# Altium project TimeKeeper.PrjPcb
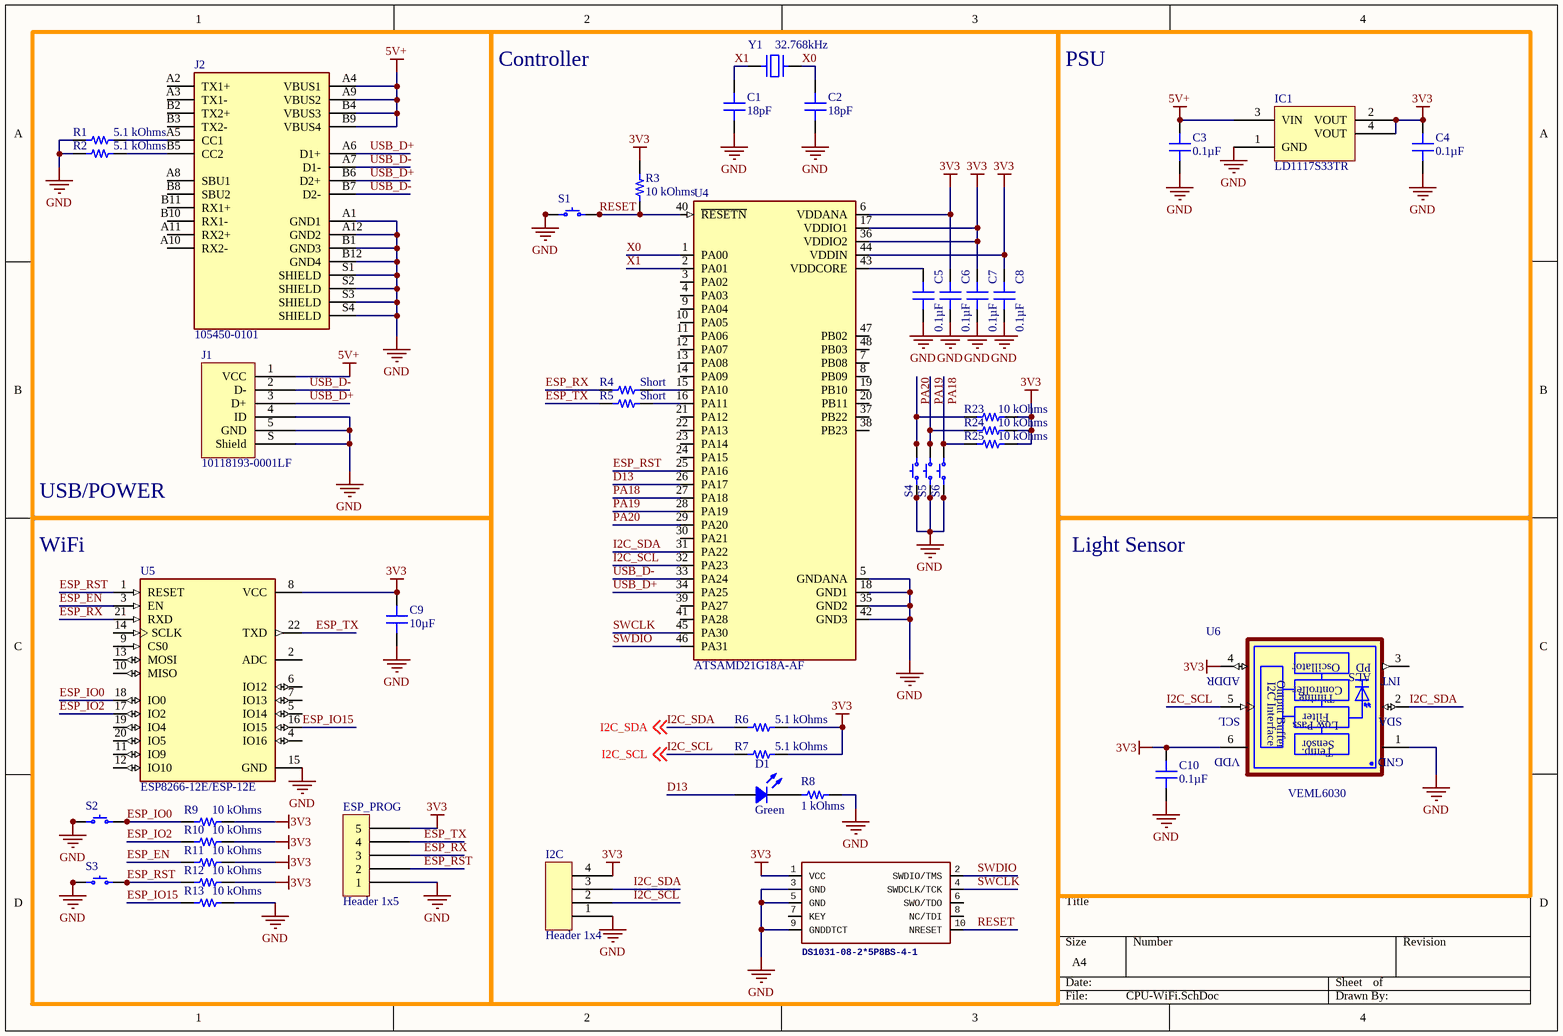
[diagram p0: CPU-WiFi.SchDoc]
2 sheets, 88 parts. Net scope: global (net labels, ports and power ports of the same name join across sheets).
Board files: TimeKeeper2Layer.PcbDoc, TimeKeeper.PcbDoc
Sheets:
  CPU-WiFi.SchDoc
  LED-DRIVER.SchDoc

## Sheet CPU-WiFi.SchDoc
size A4

### Parts
C1  18pF  [CAP 0603_1608]
C2  18pF  [CAP 0603_1608]
C3  0.1µF  [CAP 0603_1608]
C4  0.1µF  [CAP 0603_1608]
C5  0.1µF  [CAP 0603_1608]
C6  0.1µF  [CAP 0603_1608]
C7  0.1µF  [CAP 0603_1608]
C8  0.1µF  [CAP 0603_1608]
C9  10µF  [CAP 0603_1608]
C10  0.1µF  [CAP 0603_1608]
D1  Green  [LED 0805_2012 GREEN]
ESP_PROG  Header 1x5  [Header 1x5 male]
I2C  Header 1x4  [Header 1x4 male]
IC1  LD1117S33TR  [ST SOT-223]
J1  10118193-0001LF  [FCI USB 10118193-0001LF]
J2  105450-0101  [MOLEX_105450-0101]
PROG1  DS1031-08-2*5P8BS-4-1  [2X5-PTH-1.27MM]
R1  5.1 kOhms  [RES 0603_1608]
R2  5.1 kOhms  [RES 0603_1608]
R3  10 kOhms  [RES 0603_1608]
R4  Short  [RES 0603_1608]
R5  Short  [RES 0603_1608]
R6  5.1 kOhms  [RES 0603_1608]
R7  5.1 kOhms  [RES 0603_1608]
R8  1 kOhms  [RES 0603_1608]
R9  10 kOhms  [RES 0603_1608]
R10  10 kOhms  [RES 0603_1608]
R11  10 kOhms  [RES 0603_1608]
R12  10 kOhms  [RES 0603_1608]
R13  10 kOhms  [RES 0603_1608]
R23  10 kOhms  [RES 0603_1608]
R24  10 kOhms  [RES 0603_1608]
R25  10 kOhms  [RES 0603_1608]
S1  B3S-1000P  [OMRON B3S-1000P]  (value not drawn)
S2  B3S-1000P  [OMRON B3S-1000P]  (value not drawn)
S3  B3S-1000P  [OMRON B3S-1000P]  (value not drawn)
S4  B3S-1000P  [OMRON B3S-1000P]  (value not drawn)
S5  B3S-1000P  [OMRON B3S-1000P]  (value not drawn)
S6  B3S-1000P  [OMRON B3S-1000P]  (value not drawn)
U4  ATSAMD21G18A-AF  [QFP50P900X900X120-48N]
U5  ESP8266-12E/ESP-12E  [XCVR_ESP8266-12E/ESP-12E]
U6  VEML6030  [VISHAY_VEML6030_2X2X0.87]
Y1  32.768kHz  [ABRACON ABS07]

### Blocks framed on the sheet
USB/POWER: J1 J2 R1 R2
Controller: C1 C2 C5-C8 D1 I2C PROG1 R3-R8 R23-R25 S1 S4-S6 U4 Y1
PSU: C3 C4 IC1
Light Sensor: C10 U6

### Nets
3V3: C4.2 C6.2 C7.2 C8.2 C9.2 C10.2 ESP_PROG.5 I2C.4 IC1.2(VOUT) IC1.4(VOUT) PROG1.1(VCC) R3.2 R6.2 R7.2 R9.2 R10.2 R11.2 R12.2 R23.1 R24.1 R25.1 U4.6(VDDANA) U4.17(VDDIO1) U4.36(VDDIO2) U4.44(VDDIN) U5.8(VCC) U6.4(ADDR) U6.6(VDD)
5V+: C3.2 IC1.3(VIN) J1.1(VCC) J2.A4(VBUS1) J2.A9(VBUS2) J2.B4(VBUS3) J2.B9(VBUS4)
GND: C1.1 C2.1 C3.1 C4.1 C5.1 C6.1 C7.1 C8.1 C9.1 C10.1 ESP_PROG.1 I2C.1 IC1.1(GND) J1.4(ID) J1.5(GND) J1.S(Shield) J2.A1(GND1) J2.A12(GND2) J2.B1(GND3) J2.B12(GND4) J2.S1(SHIELD) J2.S2(SHIELD) J2.S3(SHIELD) J2.S4(SHIELD) PROG1.3(GND) PROG1.5(GND) PROG1.9(GNDDTCT) R1.1 R2.1 R8.2 R13.2 S1.1 S1.2 S2.1 S2.2 S3.1 S3.2 S4.1 S4.2 S5.1 S5.2 S6.1 S6.2 U4.5(GNDANA) U4.18(GND1) U4.35(GND2) U4.42(GND3) U5.15(GND) U6.1(GND)
D13: D1.1 U4.26(PA17)
ESP_EN: R11.1 U5.3(EN)
ESP_IO0: R9.1 S2.3 S2.4 U5.18(IO0)
ESP_IO2: R10.1 U5.17(IO2)
ESP_IO15: R13.1 U5.16(IO15)
ESP_RST: ESP_PROG.2 R12.1 S3.3 S3.4 U4.25(PA16) U5.1(RESET)
ESP_RX: ESP_PROG.3 R4.1 U5.21(RXD)
ESP_TX: ESP_PROG.4 R5.1 U5.22(TXD)
I2C_SCL: I2C.2 R7.1 U4.32(PA23) U6.5(SCL) ; off-sheet I2C_SCL
I2C_SDA: I2C.3 R6.1 U4.31(PA22) U6.2(SDA) ; off-sheet I2C_SDA
PA18: R25.2 S6.3 S6.4 U4.27(PA18)
PA19: R24.2 S5.3 S5.4 U4.28(PA19)
PA20: R23.2 S4.3 S4.4 U4.29(PA20)
RESET: PROG1.10(NRESET) R3.1 S1.3 S1.4 U4.40(~{RESETN})
SWCLK: PROG1.4(SWDCLK/TCK) U4.45(PA30)
SWDIO: PROG1.2(SWDIO/TMS) U4.46(PA31)
USB_D+: J1.3(D+) J2.A6(D1+) J2.B6(D2+) U4.34(PA25)
USB_D-: J1.2(D-) J2.A7(D1-) J2.B7(D2-) U4.33(PA24)
X0: C2.2 U4.1(PA00) Y1.2
X1: C1.2 U4.2(PA01) Y1.1
NetC5_2: C5.2 U4.43(VDDCORE)
NetD1_2: D1.2 R8.1
NetJ2_A5: J2.A5(CC1) R1.2
NetJ2_B5: J2.B5(CC2) R2.2
NetR4_2: R4.2 U4.15(PA10)
NetR5_2: R5.2 U4.16(PA11)

Not connected (* = marked no-connect by the designer): J2 A2(TX1+) A3(TX1-) A8(SBU1) A10(RX2-) A11(RX2+) B2(TX2+) B3(TX2-) B8(SBU2) B10(RX1-) B11(RX1+); PROG1 6(SWO/TDO) 7(KEY) 8(NC/TDI); U4 3(PA02) 4(PA03) 7(PB08) 8(PB09) 9(PA04) 10(PA05) 11(PA06) 12(PA07) 13(PA08) 14(PA09) 19(PB10) 20(PB11) 21(PA12) 22(PA13) 23(PA14) 24(PA15) 30(PA21) 37(PB22) 38(PB23) 39(PA27) 41(PA28) 47(PB02) 48(PB03); U5 2(ADC) 4(IO16) 5(IO14) 6(IO12) 7(IO13) 9(CS0) 10(MISO) 11(IO9) 12(IO10) 13(MOSI) 14(SCLK) 19(IO4) 20(IO5); U6 3(INT)

### Notes on the sheet
- WiFi
- (in symbol VEML6030) Oscillator; PD; ALS; I2C Interface; Output Buffer; Controller; Timing; Filter; Low Pass; Sensor; Temp.

### Library data of the parts
C1 C2 = C0603X180J5GACTU: CAP CER 18PF 50V C0G/NP0 0603; Manufacturer: KEMET; Temperature Coefficient: C0G, NP0; Tolerance: ±5%; Part Number: C0603X180J5GACTU; Value: 18pF; Applications: Boardflex Sensitive; Capacitance: 18pF; ComponentLink1Description: Datasheet; ComponentLink1URL: https://api.kemet.com/component-edge/download/specsheet/C0603X180J5GACTU.pdf; ComponentLink2Description: DigiKey Link; ComponentLink2URL: http://digikey.com/product-detail/en/kemet/C0603X180J5GACTU/399-7390-1-ND/3317424; Device Package: 0603 (1608 Metric); Features: Low ESL, Soft Termination; LastUpdated: 21/01/2020 00:02:09; Lifecycle Status: Active; Minimum Order: 1; Mounting Type: Surface Mount, MLCC; Operating Temperature: -55°C ~ 125°C; Package / Case: 0603 (1608 Metric); Packaging: TapeAndReel; PartId: 2471; Part Status: Active; Price: 0.08; Series: SMD Comm C0G Flex; Size / Dimension: 0.063" L x 0.031" W (1.60mm x 0.80mm); Supplier 1: DigiKey; Supplier Part Number 1: 399-7390-1-ND; Thickness (Max): 0.034" (0.87mm); Voltage - Rated: 50V
C3-C8 C10 = C0603T104K3RAL7867: CAP CER 0.1UF 25V X7R 0603; Manufacturer: KEMET; Ratings: COTS; Tolerance: ±10%; Part Number: C0603T104K3RAL7867; Value: 0.1µF; Applications: High Reliability, Bypass, Decoupling; Capacitance: 0.1µF; ComponentLink1Description: Datasheet; ComponentLink1URL: https://api.kemet.com/component-edge/download/datasheet/C0603T104K3RAL7867.pdf; ComponentLink2Description: DigiKey Link; ComponentLink2URL: http://digikey.com/product-detail/en/kemet/C0603T104K3RAL7867/399-14540-1-ND/7103832; Device Package: 0603 (1608 Metric); LastUpdated: 21/01/2020 00:02:09; Lifecycle Status: Active; Minimum Order: 1; Mounting Type: Surface Mount, MLCC; Operating Temperature: -55°C ~ 125°C; Package / Case: 0603 (1608 Metric); Packaging: TapeAndReel; PartId: 2525; Part Status: Active; Price: 0.23; Series: SMD COTS X7R; Size / Dimension: 0.063" L x 0.031" W (1.60mm x 0.80mm); Supplier 1: DigiKey; Supplier Part Number 1: 399-14540-1-ND; Temperature Coefficient: X7R; Thickness (Max): 0.034" (0.87mm); Voltage - Rated: 25V
C9 = GRM188R60J106ME47D: CAP CER 10UF 6.3V X5R 0603; Manufacturer: Murata Electronics; Tolerance: ±20%; Part Number: GRM188R60J106ME47D; Value: 10µF; Applications: General Purpose; Capacitance: 10µF; ComponentLink1Description: Datasheet; ComponentLink1URL: https://www.murata.com/~/media/webrenewal/support/library/catalog/products/capacitor/mlcc/c02e.ashx?la=en-us; ComponentLink2Description: DigiKey Link; ComponentLink2URL: http://digikey.com/product-detail/en/murata-electronics/GRM188R60J106ME47D/490-3896-1-ND/965938; Device Package: 0603 (1608 Metric); LastUpdated: 21/01/2020 00:02:09; Lifecycle Status: Active; Minimum Order: 1; Mounting Type: Surface Mount, MLCC; Operating Temperature: -55°C ~ 85°C; Package / Case: 0603 (1608 Metric); Packaging: TapeAndReel; PartId: 2351; Part Status: Active; Price: 0.08; Series: GRM; Size / Dimension: 0.063" L x 0.031" W (1.60mm x 0.80mm); Supplier 1: DigiKey; Supplier Part Number 1: 490-3896-1-ND; Temperature Coefficient: X5R; Thickness (Max): 0.035" (0.90mm); Voltage - Rated: 6.3V
D1 = SML-LX0805UPGC-TR: LED GREEN CLEAR SMD; Manufacturer: Lumex Opto/Components Inc.; Configuration: Standard; Current - Test: 20mA; Lens Color: Colorless; Lens Size: 1.40mm x 1.25mm; Lens Style: Rectangle with Flat Top; Millicandela Rating: 199mcd; Viewing Angle: 140°; Voltage - Forward (Vf) (Typ): 3.5V; Wavelength - Peak: 518nm; Part Number: SML-LX0805UPGC-TR; Color: Green; ComponentLink1Description: Datasheet; ComponentLink1URL: https://www.lumex.com/content/files/ProductAttachment/SML-LX0805UPGC-TR.pdf; ComponentLink2Description: DigiKey Link; ComponentLink2URL: http://digikey.com/product-detail/en/lumex-opto-components-inc/SML-LX0805UPGC-TR/67-1640-1-ND/408129; Device Package: 0805 (2012 Metric); LastUpdated: 21/01/2020 03:14:04; Lens Transparency: Clear; Lifecycle Status: Active; Minimum Order: 1; Mounting Type: Surface Mount; Package / Case: 0805 (2012 Metric); Packaging: TapeAndReel; PartId: 304; Part Status: Active; Price: 0.69; Series: -; Size / Dimension: 2.00mm L x 1.25mm W; Supplier 1: DigiKey; Supplier Part Number 1: 67-1640-1-ND; Value: Green
IC1 = LD1117S33TR: IC REG LINEAR 3.3V 800MA SOT223; Manufacturer: STMicroelectronics; Current - Quiescent (Iq): 10mA; Number of Regulators: 1; Output Configuration: Positive; Output Type: Fixed; Protection Features: Over Current, Over Temperature; PSRR: 75dB (120Hz); Voltage Dropout (Max): 1.2V @ 800mA; Voltage - Input (Max): 15V; Part Number: LD1117S33TR; ComponentLink1Description: Datasheet; ComponentLink1URL: http://www.st.com/content/ccc/resource/technical/document/datasheet/99/3b/7d/91/91/51/4b/be/CD00000544.pdf/files/CD00000544.pdf/jcr:content/translations/en.CD00000544.pdf; ComponentLink2Description: DigiKey Link; ComponentLink2URL: http://digikey.com/product-detail/en/stmicroelectronics/LD1117S33TR/497-1242-1-ND/586242; Current - Output: 800mA; Device Package: TO-261-4, TO-261AA; LastUpdated: 21/01/2020 03:56:43; Lifecycle Status: Active; Minimum Order: 1; Mounting Type: Surface Mount; Operating Temperature: 0°C ~ 125°C; Package / Case: TO-261-4, TO-261AA; Packaging: TapeAndReel; Part Status: Active; Price: 0.14; Series: -; Supplier 1: DigiKey; Supplier Part Number 1: 497-1242-1-ND; Supplier Device Package: SOT-223; Voltage - Output (Min/Fixed): 3.3V
J1 = 10118193-0001LF: CONN RCPT USB2.0 MICRO B SMD R/A; Manufacturer: Amphenol ICC (FCI); Connector Type: USB - micro B; Current Rating (Amps): 1.8A per Contact; Gender: Receptacle; Mating Cycles: 10000; Number of Contacts: 5; Number of Ports: 1; Shielding: Shielded; Voltage - Rated: 100VAC; Part Number: 10118193-0001LF; ComponentLink1Description: Datasheet; ComponentLink1URL: https://cdn.amphenol-icc.com/media/wysiwyg/files/documentation/datasheet/inputoutput/io_usb_micro.pdf; ComponentLink2Description: DigiKey Link; ComponentLink2URL: //digikey.com/product-detail/en/amphenol-icc-fci/10118193-0001LF/609-4616-2-ND/2785388; Features: Solder Retention; LastUpdated: 09/12/2019 20:51:28; Lifecycle Status: 0; Minimum Order: 1; Mounting Feature: Horizontal; Mounting Type: Surface Mount, Right Angle; Through Hole; Operating Temperature: -30°C ~ 80°C; Packaging: TapeAndReel; Part Status: Active; Price: 0.21; Series: -; Specifications: USB 2.0; Supplier 1: DigiKey; Supplier Part Number 1: 609-4616-2-ND; Termination: Solder
J2 = 105450-0101: USB-C _USB TYPE-C_ USB 3.1 _USB 3.1 Gen 2, Superspeed+_ Receptacle Connector 24 Position Surface Mount, Right Angle; Through Hole; MF: Molex; MP: 1054500101; Package: None; Digi-Key_Part_Number: WM12856CT-ND; SnapEDA_Link: https://www.snapeda.com/parts/1054500101/Molex/view-part/448528/?ref=snap; Digi-Key_Purchase_URL: https://www.digikey.tw/product-detail/en/molex/1054500101/WM12856CT-ND/5843891?utm_source=snapeda&utm_medium=aggregator&utm_campaign=symbol; Value: *
PROG1 = CORTEX_DEBUGPTH: Cortex Debug ConnectorDatasheet; GateName_1: G$1; DeviceName: PTH; SymbolName_1: CORTEX_DEBUG; LibraryName: samd21; DeviceSetName: CORTEX_DEBUG; NAME: *
R1 R2 R6 R7 = AC0603JR-075K1L: RES SMD 5.1K OHM 5% 1/10W 0603; Manufacturer: Yageo; Power (Watts): 0.1W, 1/10W; Temperature Coefficient: ±100ppm/°C; Part Number: AC0603JR-075K1L; Value: 5.1 kOhms; ComponentLink1Description: Datasheet; ComponentLink1URL: https://www.yageo.com/upload/media/product/productsearch/datasheet/rchip/PYu-AC_51_RoHS_L_7.pdf; ComponentLink2Description: DigiKey Link; ComponentLink2URL: http://digikey.com/product-detail/en/yageo/AC0603JR-075K1L/YAG3682CT-ND/6006531; Composition: Thick Film; Device Package: 0603 (1608 Metric); Features: Automotive AEC-Q200, Moisture Resistant; Height - Seated (Max): 0.022" (0.55mm); LastUpdated: 21/01/2020 00:23:35; Lifecycle Status: Active; Minimum Order: 1; Number of Terminations: 2; Operating Temperature: -55°C ~ 155°C; Package / Case: 0603 (1608 Metric); Packaging: CutTape; PartId: 8336; Part Status: Active; Price: 0.10; Ratings: AEC-Q200; Resistance: 5.1 kOhms; Series: AC; Size / Dimension: 0.063" L x 0.031" W (1.60mm x 0.80mm); Supplier 1: DigiKey; Supplier Part Number 1: YAG3682CT-ND; Supplier Device Package: 0603; Tolerance: ±5%
R3 R9-R13 R23-R25 = CPF0603B10KE: RES SMD 10K OHM 0.1% 1/16W 0603; Manufacturer: TE Connectivity Passive Product; Power (Watts): 0.063W, 1/16W; Temperature Coefficient: ±25ppm/°C; Part Number: CPF0603B10KE; Value: 10 kOhms; ComponentLink1Description: Datasheet; ComponentLink1URL: https://www.te.com/commerce/DocumentDelivery/DDEController?Action=srchrtrv&DocNm=1773200&DocType=DS&DocLang=English; ComponentLink2Description: DigiKey Link; ComponentLink2URL: http://digikey.com/product-detail/en/te-connectivity-passive-product/CPF0603B10KE/A119886CT-ND/4966484; Composition: Thin Film; Device Package: 0603 (1608 Metric); Height - Seated (Max): 0.022" (0.55mm); LastUpdated: 21/01/2020 00:24:55; Lifecycle Status: Active; Minimum Order: 1; Number of Terminations: 2; Operating Temperature: -55°C ~ 155°C; Package / Case: 0603 (1608 Metric); Packaging: TapeAndReel; PartId: 4872; Part Status: Active; Price: 0.09; Resistance: 10 kOhms; Series: CPF, Neohm; Size / Dimension: 0.061" L x 0.031" W (1.55mm x 0.80mm); Supplier 1: DigiKey; Supplier Part Number 1: A119886CT-ND; Supplier Device Package: 0603; Tolerance: ±0.1%
R4 R5 = HCJ0603ZT0R00: RES 0 OHM JUMPER 1/4W 0603; Manufacturer: Stackpole Electronics Inc; Power (Watts): 0.25W, 1/4W; Resistance: 0 Ohms; Part Number: HCJ0603ZT0R00; Value: Short; ComponentLink1Description: Datasheet; ComponentLink1URL: https://www.seielect.com/catalog/sei-hcj.pdf; ComponentLink2Description: DigiKey Link; ComponentLink2URL: http://digikey.com/product-detail/en/stackpole-electronics-inc/HCJ0603ZT0R00/HCJ0603ZT0R00CT-ND/4357665; Composition: Metal Foil; Device Package: 0603 (1608 Metric); Features: Automotive AEC-Q200; Height - Seated (Max): 0.018" (0.45mm); LastUpdated: 21/01/2020 00:22:48; Lifecycle Status: Active; Minimum Order: 1; Number of Terminations: 2; Operating Temperature: -55°C ~ 155°C; Package / Case: 0603 (1608 Metric); Packaging: TapeAndReel; PartId: 10189; Part Status: Active; Price: 0.07; Ratings: AEC-Q200; Series: HCJ; Size / Dimension: 0.061" L x 0.031" W (1.55mm x 0.80mm); Supplier 1: DigiKey; Supplier Part Number 1: HCJ0603ZT0R00CT-ND; Supplier Device Package: 0603; Tolerance: Jumper
R8 = CR0603-FX-1001ELF: RES SMD 1K OHM 1% 1/10W 0603; Manufacturer: Bourns Inc.; Power (Watts): 0.1W, 1/10W; Temperature Coefficient: ±100ppm/°C; Part Number: CR0603-FX-1001ELF; Value: 1 kOhms; ComponentLink1Description: Datasheet; ComponentLink1URL: https://www.bourns.com/docs/Product-Datasheets/CHPREZTR.pdf; ComponentLink2Description: DigiKey Link; ComponentLink2URL: http://digikey.com/product-detail/en/bourns-inc/CR0603-FX-1001ELF/CR0603-FX-1001ELFCT-ND/3592910; Composition: Thick Film; Device Package: 0603 (1608 Metric); Features: Moisture Resistant; Height - Seated (Max): 0.022" (0.55mm); LastUpdated: 21/01/2020 00:19:55; Lifecycle Status: Active; Minimum Order: 1; Number of Terminations: 2; Operating Temperature: -55°C ~ 155°C; Package / Case: 0603 (1608 Metric); Packaging: CutTape; PartId: 17323; Part Status: Active; Price: 0.10; Resistance: 1 kOhms; Series: CR0603; Size / Dimension: 0.063" L x 0.031" W (1.60mm x 0.80mm); Supplier 1: DigiKey; Supplier Part Number 1: CR0603-FX-1001ELFCT-ND; Supplier Device Package: 0603; Tolerance: ±1%
S1-S6 = B3S-1000P: SWITCH TACTILE SPST-NO 0.05A 24V; Manufacturer: Omron Electronics Inc-EMC Div; Actuator Height off PCB, Vertical: 4.30mm; Actuator Orientation: Top Actuated; Actuator Type: Standard; Contact Rating @ Voltage: 0.05A @ 24VDC; Illumination: Non-Illuminated; Ingress Protection: IP67 - Dust Tight, Waterproof; Operating Force: 160gf; Outline: 6.60mm x 6.00mm; Switch Function: Off-Mom; Part Number: B3S-1000P; Circuit: SPST-NO; ComponentLink1Description: Datasheet; ComponentLink1URL: https://omronfs.omron.com/en_US/ecb/products/pdf/en-b3s.pdf; ComponentLink2Description: DigiKey Link; ComponentLink2URL: http://digikey.com/product-detail/en/omron-electronics-inc-emc-div/B3S-1000P/SW836CT-ND/700012; Features: Sealed - Fully; LastUpdated: 31/01/2020 01:36:13; Lifecycle Status: Active; Minimum Order: 1; Mounting Type: Surface Mount; Operating Temperature: -25°C ~ 70°C; Packaging: TapeAndReel; Part Status: Active; Price: 0.39; Series: B3S; Supplier 1: DigiKey; Supplier Part Number 1: SW836CT-ND; Termination Style: Gull Wing
U4 = ATSAMD21G18A-AF: ARMÂ® CortexÂ®-M0+ Automotive, AEC-Q100, SAM D21G Microcontroller IC 32-Bit 48MHz 256KB _256K x 8_ FLASH 48-TQFP _7x7_; MF: Microchip; Availability: Unavailable; MP: ATSAMD21G18A-AF; Package: TQFP-48 Microchip; SnapEDA_Link: https://www.snapeda.com/parts/ATSAMD21G18A-AF/Microchip/view-part/1216117/?ref=snap; Value: *; Price: None
U5 = ESP8266-12E/ESP-12E: This WiFi module has a 32-bit MCU micro and clock speeds supporting 80 MHz or 160 MHz. Supports the RTOS and integrated Wi-Fi MAC/BB/RF/PA/LNA, and has an on-board antenna.; MF: AI-Thinker; Price: None; Package: None; Value: *; MP: ESP8266-12E/ESP-12E; Availability: Unavailable; SnapEDA_Link: https://www.snapeda.com/parts/ESP8266-12E/ESP-12E/AI-Thinker/view-part/106414/?ref=snap
U6 = VEML6030: Optical Sensor Ambient 550nm IÂ²C 6-SMD, No Lead; MF: Vishay; Value: *; Price: None; Package: SMD-6 Vishay; SnapEDA_Link: https://www.snapeda.com/parts/VEML6030/Vishay%20Semiconductor%20Opto%20Division/view-part/493148/?ref=snap; Availability: Unavailable; MP: VEML6030
Y1 = ABS07-32.768KHZ-T: CRYSTAL 32.7680KHZ 12.5PF SMD; Manufacturer: Abracon LLC; ESR (Equivalent Series Resistance): 70 kOhms; Frequency Tolerance: ±20ppm; Operating Mode: Fundamental; Part Number: ABS07-32.768KHZ-T; ComponentLink1Description: Datasheet; ComponentLink1URL: https://abracon.com/Resonators/ABS07.pdf; ComponentLink2Description: DigiKey Link; ComponentLink2URL: http://digikey.com/product-detail/en/abracon-llc/ABS07-32.768KHZ-T/535-9542-1-ND/1237009; Device Package: 2-SMD, No Lead; Frequency: 32.768kHz; Height - Seated (Max): 0.035" (0.90mm); LastUpdated: 21/01/2020 03:21:15; Lifecycle Status: Active; Load Capacitance: 12.5pF; Minimum Order: 1; Mounting Type: Surface Mount; Operating Temperature: -40°C ~ 85°C; Package / Case: 2-SMD, No Lead; Packaging: TapeAndReel; PartId: 382; Part Status: Active; Price: 0.32; Series: ABS07; Size / Dimension: 0.126" L x 0.059" W (3.20mm x 1.50mm); Supplier 1: DigiKey; Supplier Part Number 1: 535-9542-1-ND; Type: kHz Crystal (Tuning Fork); Value: 32.768kHz

## Sheet LED-DRIVER.SchDoc
size A3
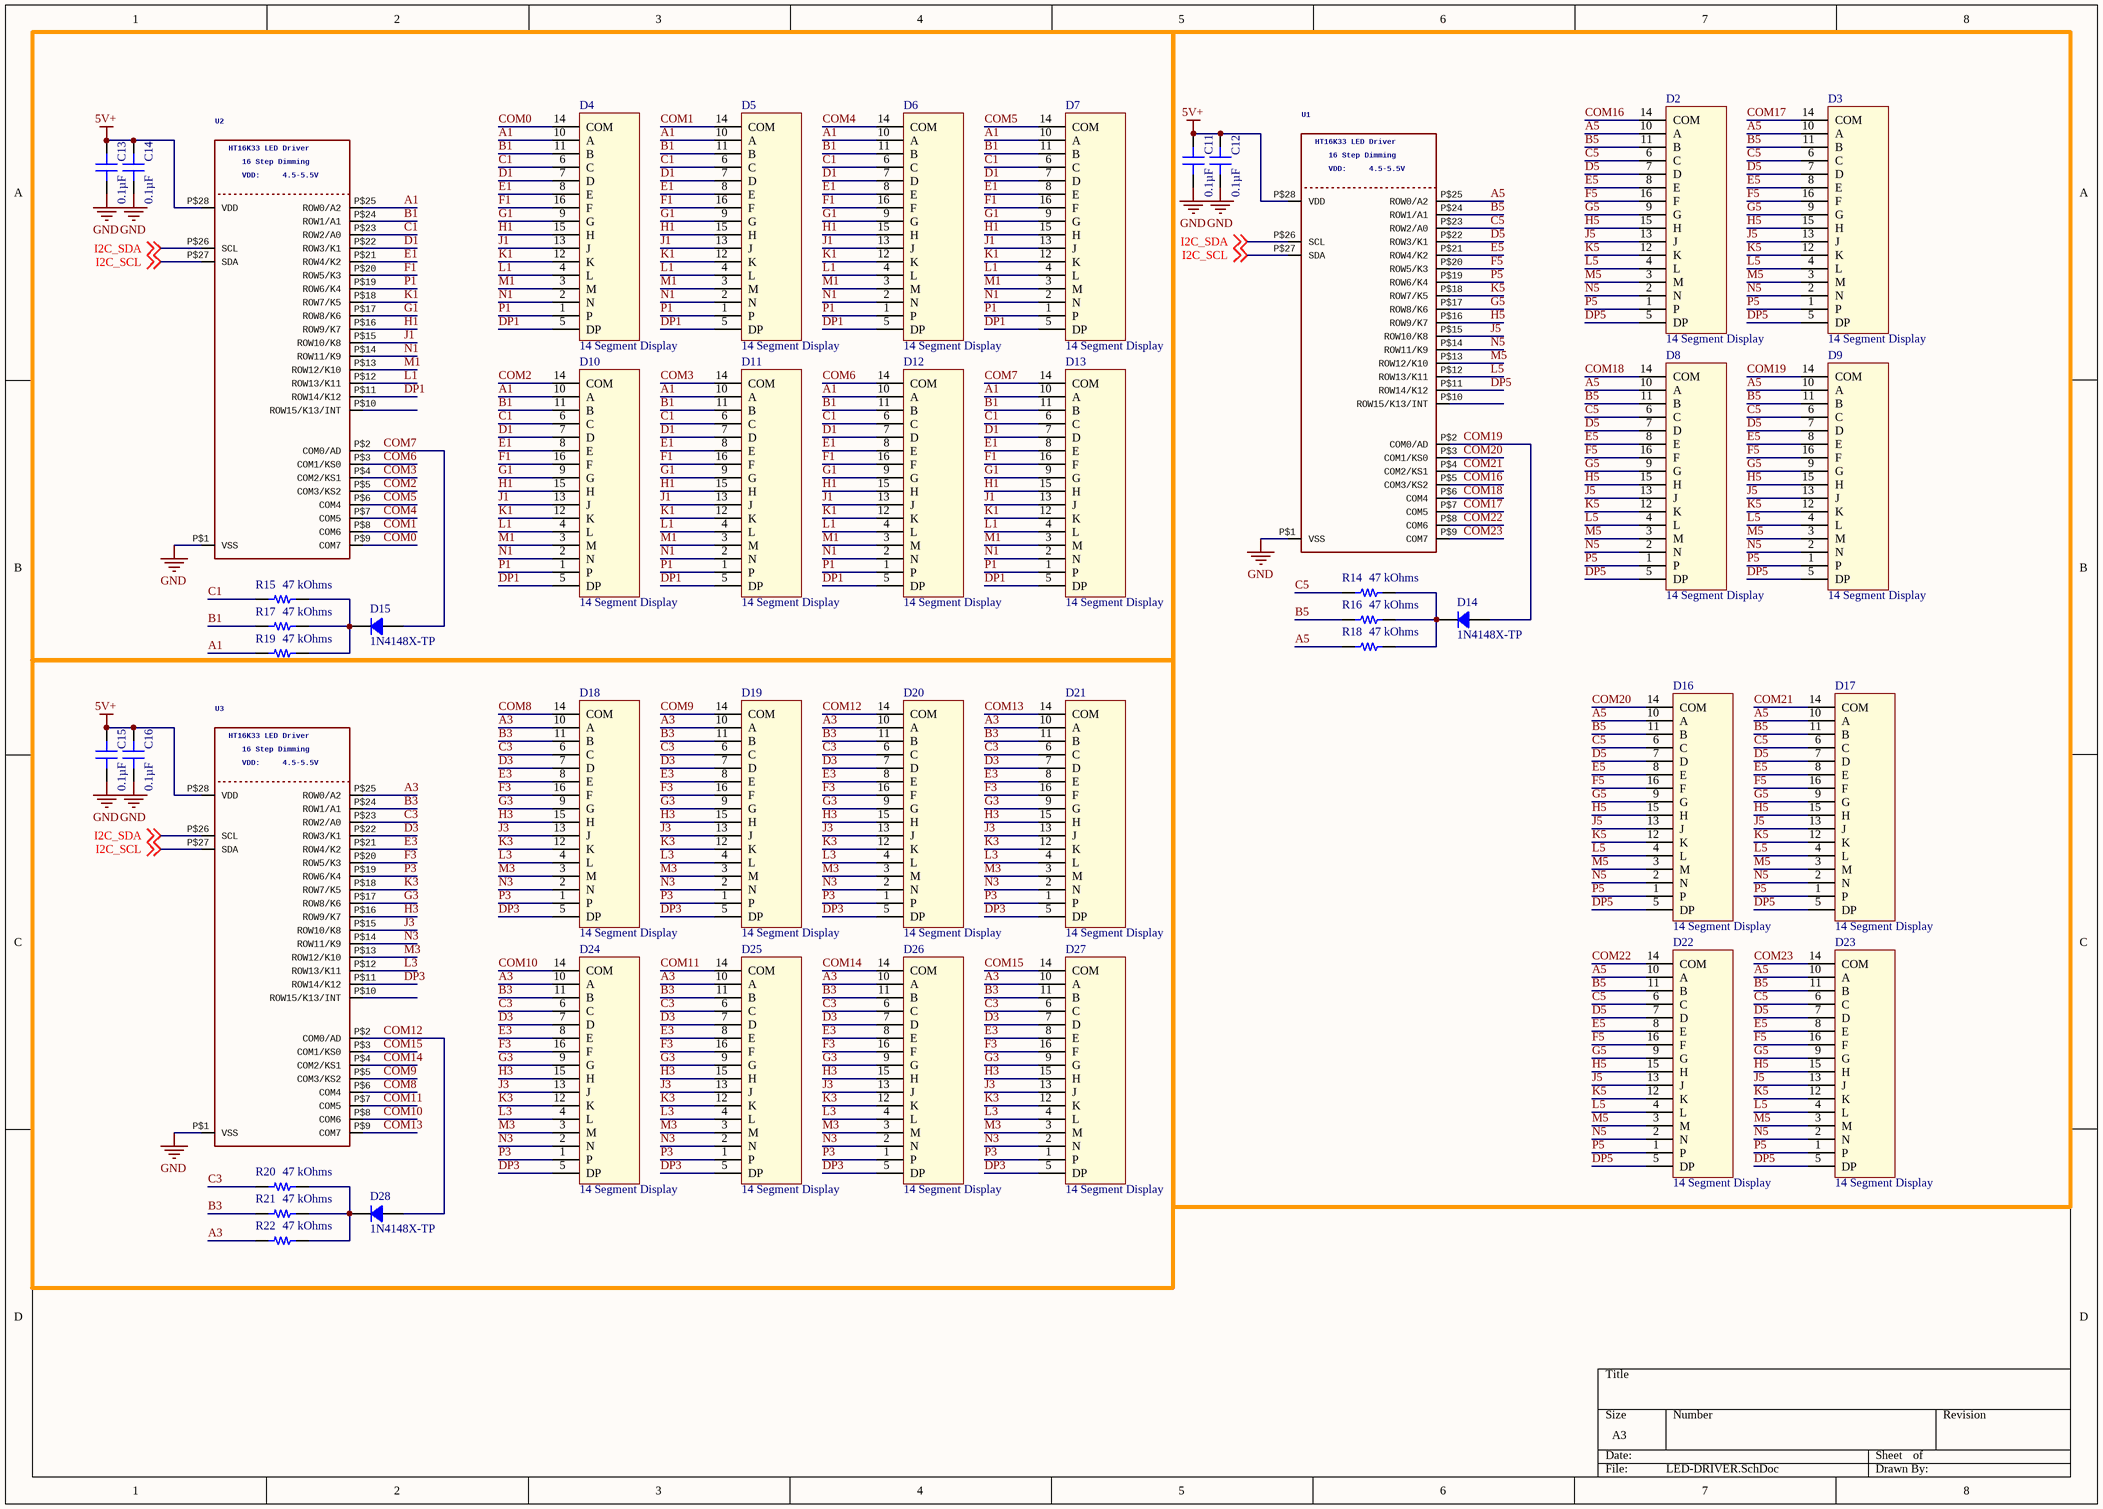
[diagram p1: LED-DRIVER.SchDoc]

### Parts
C11  0.1µF  [CAP 0603_1608]
C12  0.1µF  [CAP 0603_1608]
C13  0.1µF  [CAP 0603_1608]
C14  0.1µF  [CAP 0603_1608]
C15  0.1µF  [CAP 0603_1608]
C16  0.1µF  [CAP 0603_1608]
D2  14 Segment Display  [14 Seg Display]
D3  14 Segment Display  [14 Seg Display]
D4  14 Segment Display  [14 Seg Display]
D5  14 Segment Display  [14 Seg Display]
D6  14 Segment Display  [14 Seg Display]
D7  14 Segment Display  [14 Seg Display]
D8  14 Segment Display  [14 Seg Display]
D9  14 Segment Display  [14 Seg Display]
D10  14 Segment Display  [14 Seg Display]
D11  14 Segment Display  [14 Seg Display]
D12  14 Segment Display  [14 Seg Display]
D13  14 Segment Display  [14 Seg Display]
D14  1N4148X-TP  [SOD-523]
D15  1N4148X-TP  [SOD-523]
D16  14 Segment Display  [14 Seg Display]
D17  14 Segment Display  [14 Seg Display]
D18  14 Segment Display  [14 Seg Display]
D19  14 Segment Display  [14 Seg Display]
D20  14 Segment Display  [14 Seg Display]
D21  14 Segment Display  [14 Seg Display]
D22  14 Segment Display  [14 Seg Display]
D23  14 Segment Display  [14 Seg Display]
D24  14 Segment Display  [14 Seg Display]
D25  14 Segment Display  [14 Seg Display]
D26  14 Segment Display  [14 Seg Display]
D27  14 Segment Display  [14 Seg Display]
D28  1N4148X-TP  [SOD-523]
R14  47 kOhms  [RES 0603_1608]
R15  47 kOhms  [RES 0603_1608]
R16  47 kOhms  [RES 0603_1608]
R17  47 kOhms  [RES 0603_1608]
R18  47 kOhms  [RES 0603_1608]
R19  47 kOhms  [RES 0603_1608]
R20  47 kOhms  [RES 0603_1608]
R21  47 kOhms  [RES 0603_1608]
R22  47 kOhms  [RES 0603_1608]
U1  HT16K33LEDDriver: HT16K33 LED Driver  VDD: VDD:  16StepDimming: 16 Step Dimming  [SOP28_300MIL_SKINNY]  (hidden comment: HT16K33_SOP28_SKINNY)
U2  HT16K33LEDDriver: HT16K33 LED Driver  VDD: VDD:  16StepDimming: 16 Step Dimming  [SOP28_300MIL_SKINNY]  (hidden comment: HT16K33_SOP28_SKINNY)
U3  HT16K33LEDDriver: HT16K33 LED Driver  VDD: VDD:  16StepDimming: 16 Step Dimming  [SOP28_300MIL_SKINNY]  (hidden comment: HT16K33_SOP28_SKINNY)

### Nets
5V+: C11.2 C12.2 C13.2 C14.2 C15.2 C16.2 U1.P$28(VDD) U2.P$28(VDD) U3.P$28(VDD)
GND: C11.1 C12.1 C13.1 C14.1 C15.1 C16.1 U1.P$1(VSS) U2.P$1(VSS) U3.P$1(VSS)
A1: D4.10(A) D5.10(A) D6.10(A) D7.10(A) D10.10(A) D11.10(A) D12.10(A) D13.10(A) R19.1 U2.P$25(ROW0/A2)
A3: D18.10(A) D19.10(A) D20.10(A) D21.10(A) D24.10(A) D25.10(A) D26.10(A) D27.10(A) R22.1 U3.P$25(ROW0/A2)
A5: D2.10(A) D3.10(A) D8.10(A) D9.10(A) D16.10(A) D17.10(A) D22.10(A) D23.10(A) R18.1 U1.P$25(ROW0/A2)
B1: D4.11(B) D5.11(B) D6.11(B) D7.11(B) D10.11(B) D11.11(B) D12.11(B) D13.11(B) R17.1 U2.P$24(ROW1/A1)
B3: D18.11(B) D19.11(B) D20.11(B) D21.11(B) D24.11(B) D25.11(B) D26.11(B) D27.11(B) R21.1 U3.P$24(ROW1/A1)
B5: D2.11(B) D3.11(B) D8.11(B) D9.11(B) D16.11(B) D17.11(B) D22.11(B) D23.11(B) R16.1 U1.P$24(ROW1/A1)
C1: D4.6(C) D5.6(C) D6.6(C) D7.6(C) D10.6(C) D11.6(C) D12.6(C) D13.6(C) R15.1 U2.P$23(ROW2/A0)
C3: D18.6(C) D19.6(C) D20.6(C) D21.6(C) D24.6(C) D25.6(C) D26.6(C) D27.6(C) R20.1 U3.P$23(ROW2/A0)
C5: D2.6(C) D3.6(C) D8.6(C) D9.6(C) D16.6(C) D17.6(C) D22.6(C) D23.6(C) R14.1 U1.P$23(ROW2/A0)
COM0: D4.14(COM) U2.P$9(COM7)
COM1: D5.14(COM) U2.P$8(COM6)
COM2: D10.14(COM) U2.P$5(COM3/KS2)
COM3: D11.14(COM) U2.P$4(COM2/KS1)
COM4: D6.14(COM) U2.P$7(COM5)
COM5: D7.14(COM) U2.P$6(COM4)
COM6: D12.14(COM) U2.P$3(COM1/KS0)
COM7: D13.14(COM) D15.1 U2.P$2(COM0/AD)
COM8: D18.14(COM) U3.P$6(COM4)
COM9: D19.14(COM) U3.P$5(COM3/KS2)
COM10: D24.14(COM) U3.P$8(COM6)
COM11: D25.14(COM) U3.P$7(COM5)
COM12: D20.14(COM) D28.1 U3.P$2(COM0/AD)
COM13: D21.14(COM) U3.P$9(COM7)
COM14: D26.14(COM) U3.P$4(COM2/KS1)
COM15: D27.14(COM) U3.P$3(COM1/KS0)
COM16: D2.14(COM) U1.P$5(COM3/KS2)
COM17: D3.14(COM) U1.P$7(COM5)
COM18: D8.14(COM) U1.P$6(COM4)
COM19: D9.14(COM) D14.1 U1.P$2(COM0/AD)
COM20: D16.14(COM) U1.P$3(COM1/KS0)
COM21: D17.14(COM) U1.P$4(COM2/KS1)
COM22: D22.14(COM) U1.P$8(COM6)
COM23: D23.14(COM) U1.P$9(COM7)
D1: D4.7(D) D5.7(D) D6.7(D) D7.7(D) D10.7(D) D11.7(D) D12.7(D) D13.7(D) U2.P$22(ROW3/K1)
D3: D18.7(D) D19.7(D) D20.7(D) D21.7(D) D24.7(D) D25.7(D) D26.7(D) D27.7(D) U3.P$22(ROW3/K1)
D5: D2.7(D) D3.7(D) D8.7(D) D9.7(D) D16.7(D) D17.7(D) D22.7(D) D23.7(D) U1.P$22(ROW3/K1)
DP1: D4.5(DP) D5.5(DP) D6.5(DP) D7.5(DP) D10.5(DP) D11.5(DP) D12.5(DP) D13.5(DP) U2.P$11(ROW14/K12)
DP3: D18.5(DP) D19.5(DP) D20.5(DP) D21.5(DP) D24.5(DP) D25.5(DP) D26.5(DP) D27.5(DP) U3.P$11(ROW14/K12)
DP5: D2.5(DP) D3.5(DP) D8.5(DP) D9.5(DP) D16.5(DP) D17.5(DP) D22.5(DP) D23.5(DP) U1.P$11(ROW14/K12)
E1: D4.8(E) D5.8(E) D6.8(E) D7.8(E) D10.8(E) D11.8(E) D12.8(E) D13.8(E) U2.P$21(ROW4/K2)
E3: D18.8(E) D19.8(E) D20.8(E) D21.8(E) D24.8(E) D25.8(E) D26.8(E) D27.8(E) U3.P$21(ROW4/K2)
E5: D2.8(E) D3.8(E) D8.8(E) D9.8(E) D16.8(E) D17.8(E) D22.8(E) D23.8(E) U1.P$21(ROW4/K2)
F1: D4.16(F) D5.16(F) D6.16(F) D7.16(F) D10.16(F) D11.16(F) D12.16(F) D13.16(F) U2.P$20(ROW5/K3)
F3: D18.16(F) D19.16(F) D20.16(F) D21.16(F) D24.16(F) D25.16(F) D26.16(F) D27.16(F) U3.P$20(ROW5/K3)
F5: D2.16(F) D3.16(F) D8.16(F) D9.16(F) D16.16(F) D17.16(F) D22.16(F) D23.16(F) U1.P$20(ROW5/K3)
G1: D4.9(G) D5.9(G) D6.9(G) D7.9(G) D10.9(G) D11.9(G) D12.9(G) D13.9(G) U2.P$17(ROW8/K6)
G3: D18.9(G) D19.9(G) D20.9(G) D21.9(G) D24.9(G) D25.9(G) D26.9(G) D27.9(G) U3.P$17(ROW8/K6)
G5: D2.9(G) D3.9(G) D8.9(G) D9.9(G) D16.9(G) D17.9(G) D22.9(G) D23.9(G) U1.P$17(ROW8/K6)
H1: D4.15(H) D5.15(H) D6.15(H) D7.15(H) D10.15(H) D11.15(H) D12.15(H) D13.15(H) U2.P$16(ROW9/K7)
H3: D18.15(H) D19.15(H) D20.15(H) D21.15(H) D24.15(H) D25.15(H) D26.15(H) D27.15(H) U3.P$16(ROW9/K7)
H5: D2.15(H) D3.15(H) D8.15(H) D9.15(H) D16.15(H) D17.15(H) D22.15(H) D23.15(H) U1.P$16(ROW9/K7)
I2C_SCL: U1.P$27(SDA) U2.P$27(SDA) U3.P$27(SDA) ; off-sheet I2C_SCL
I2C_SDA: U1.P$26(SCL) U2.P$26(SCL) U3.P$26(SCL) ; off-sheet I2C_SDA
J1: D4.13(J) D5.13(J) D6.13(J) D7.13(J) D10.13(J) D11.13(J) D12.13(J) D13.13(J) U2.P$15(ROW10/K8)
J3: D18.13(J) D19.13(J) D20.13(J) D21.13(J) D24.13(J) D25.13(J) D26.13(J) D27.13(J) U3.P$15(ROW10/K8)
J5: D2.13(J) D3.13(J) D8.13(J) D9.13(J) D16.13(J) D17.13(J) D22.13(J) D23.13(J) U1.P$15(ROW10/K8)
K1: D4.12(K) D5.12(K) D6.12(K) D7.12(K) D10.12(K) D11.12(K) D12.12(K) D13.12(K) U2.P$18(ROW7/K5)
K3: D18.12(K) D19.12(K) D20.12(K) D21.12(K) D24.12(K) D25.12(K) D26.12(K) D27.12(K) U3.P$18(ROW7/K5)
K5: D2.12(K) D3.12(K) D8.12(K) D9.12(K) D16.12(K) D17.12(K) D22.12(K) D23.12(K) U1.P$18(ROW7/K5)
L1: D4.4(L) D5.4(L) D6.4(L) D7.4(L) D10.4(L) D11.4(L) D12.4(L) D13.4(L) U2.P$12(ROW13/K11)
L3: D18.4(L) D19.4(L) D20.4(L) D21.4(L) D24.4(L) D25.4(L) D26.4(L) D27.4(L) U3.P$12(ROW13/K11)
L5: D2.4(L) D3.4(L) D8.4(L) D9.4(L) D16.4(L) D17.4(L) D22.4(L) D23.4(L) U1.P$12(ROW13/K11)
M1: D4.3(M) D5.3(M) D6.3(M) D7.3(M) D10.3(M) D11.3(M) D12.3(M) D13.3(M) U2.P$13(ROW12/K10)
M3: D18.3(M) D19.3(M) D20.3(M) D21.3(M) D24.3(M) D25.3(M) D26.3(M) D27.3(M) U3.P$13(ROW12/K10)
M5: D2.3(M) D3.3(M) D8.3(M) D9.3(M) D16.3(M) D17.3(M) D22.3(M) D23.3(M) U1.P$13(ROW12/K10)
N1: D4.2(N) D5.2(N) D6.2(N) D7.2(N) D10.2(N) D11.2(N) D12.2(N) D13.2(N) U2.P$14(ROW11/K9)
N3: D18.2(N) D19.2(N) D20.2(N) D21.2(N) D24.2(N) D25.2(N) D26.2(N) D27.2(N) U3.P$14(ROW11/K9)
N5: D2.2(N) D3.2(N) D8.2(N) D9.2(N) D16.2(N) D17.2(N) D22.2(N) D23.2(N) U1.P$14(ROW11/K9)
P1: D4.1(P) D5.1(P) D6.1(P) D7.1(P) D10.1(P) D11.1(P) D12.1(P) D13.1(P) U2.P$19(ROW6/K4)
P3: D18.1(P) D19.1(P) D20.1(P) D21.1(P) D24.1(P) D25.1(P) D26.1(P) D27.1(P) U3.P$19(ROW6/K4)
P5: D2.1(P) D3.1(P) D8.1(P) D9.1(P) D16.1(P) D17.1(P) D22.1(P) D23.1(P) U1.P$19(ROW6/K4)
NetD14_2: D14.2 R14.2 R16.2 R18.2
NetD15_2: D15.2 R15.2 R17.2 R19.2
NetD28_2: D28.2 R20.2 R21.2 R22.2

Not connected (* = marked no-connect by the designer): U1 P$10(ROW15/K13/INT); U2 P$10(ROW15/K13/INT); U3 P$10(ROW15/K13/INT)

### Library data of the parts
C11-C16 = C0603T104K3RAL7867: as C3 on sheet CPU-WiFi; Part Number: C0603T104K3RAL7867; Value: 0.1µF; Applications: High Reliability, Bypass, Decoupling; Capacitance: 0.1µF; ComponentLink1Description: Datasheet; ComponentLink1URL: https://api.kemet.com/component-edge/download/datasheet/C0603T104K3RAL7867.pdf; ComponentLink2Description: DigiKey Link; ComponentLink2URL: http://digikey.com/product-detail/en/kemet/C0603T104K3RAL7867/399-14540-1-ND/7103832; Device Package: 0603 (1608 Metric); LastUpdated: 21/01/2020 00:02:09; Lifecycle Status: Active; Minimum Order: 1; Mounting Type: Surface Mount, MLCC; Operating Temperature: -55°C ~ 125°C; Package / Case: 0603 (1608 Metric); Packaging: TapeAndReel; PartId: 2525; Part Status: Active; Price: 0.23; Series: SMD COTS X7R; Size / Dimension: 0.063" L x 0.031" W (1.60mm x 0.80mm); Supplier 1: DigiKey; Supplier Part Number 1: 399-14540-1-ND; Temperature Coefficient: X7R; Thickness (Max): 0.034" (0.87mm); Voltage - Rated: 25V
D2-D13 D16-D27 = 14 Segment Display: 14 Segment display red 2 char
D14 D15 D28 = 1N4148X-TP: DIODE GEN PURP 75V 150MA SOD523; Manufacturer: Micro Commercial Co; Capacitance @ Vr, F: 2pF @ 0V, 1MHz; Current - Reverse Leakage @ Vr: 1µA @ 75V; Diode Type: Standard; Reverse Recovery Time (trr): 4ns; Speed: Small Signal =< 200mA (Io), Any Speed; Voltage - Forward (Vf) (Max) @ If: 1.25V @ 150mA; Part Number: 1N4148X-TP; ComponentLink1Description: Datasheet; ComponentLink1URL: https://www.mccsemi.com/pdf/Products/1N4148X(SOD-523).PDF; ComponentLink2Description: DigiKey Link; ComponentLink2URL: http://digikey.com/product-detail/en/micro-commercial-co/1N4148X-TP/1N4148XTPMSCT-ND/789335; Current - Average Rectified (Io): 150mA; Device Package: SC-79, SOD-523; LastUpdated: 21/01/2020 03:36:43; Lifecycle Status: Active; Minimum Order: 1; Mounting Type: Surface Mount; Operating Temperature - Junction: -65°C ~ 150°C; Package / Case: SC-79, SOD-523; Packaging: TapeAndReel; PartId: 2733; Part Status: Active; Price: 0.02; Series: -; Supplier 1: DigiKey; Supplier Part Number 1: 1N4148XTPMSCT-ND; Supplier Device Package: SOD-523; Voltage - DC Reverse (Vr) (Max): 75V
R14-R22 = ERA-3AEB473V: RES SMD 47K OHM 0.1% 1/10W 0603; Manufacturer: Panasonic Electronic Components; Power (Watts): 0.1W, 1/10W; Temperature Coefficient: ±25ppm/°C; Part Number: ERA-3AEB473V; Value: 47 kOhms; ComponentLink1Description: Datasheet; ComponentLink1URL: https://industrial.panasonic.com/cdbs/www-data/pdf/RDM0000/AOA0000C307.pdf; ComponentLink2Description: DigiKey Link; ComponentLink2URL: http://digikey.com/product-detail/en/panasonic-electronic-components/ERA-3AEB473V/P47KDBCT-ND/1466092; Composition: Thin Film; Device Package: 0603 (1608 Metric); Features: Automotive AEC-Q200; Height - Seated (Max): 0.022" (0.55mm); LastUpdated: 21/01/2020 00:24:44; Lifecycle Status: Active; Minimum Order: 1; Number of Terminations: 2; Operating Temperature: -55°C ~ 155°C; Package / Case: 0603 (1608 Metric); Packaging: TapeAndReel; PartId: 5512; Part Status: Active; Price: 0.04; Ratings: AEC-Q200; Resistance: 47 kOhms; Series: ERA-3A; Size / Dimension: 0.063" L x 0.031" W (1.60mm x 0.80mm); Supplier 1: DigiKey; Supplier Part Number 1: P47KDBCT-ND; Supplier Device Package: 0603; Tolerance: ±0.1%
U1-U3 = HT16K33_SOP28_SKINNY: GateName_1: G$1; SymbolName_1: HT16K33_28PIN; DeviceName: _SKINNY; LibraryName: microbuilder; DeviceSetName: HT16K33_SOP28; 4.5-5.5V: 4.5-5.5V

## Nets that join several sheets
5V+: CPU-WiFi (7 pins), LED-DRIVER (9 pins)
GND: CPU-WiFi (49 pins), LED-DRIVER (9 pins)
I2C_SCL: CPU-WiFi (I2C.2 R7.1 U4.32 U6.5), LED-DRIVER (U1.P$27 U2.P$27 U3.P$27)
I2C_SDA: CPU-WiFi (I2C.3 R6.1 U4.31 U6.2), LED-DRIVER (U1.P$26 U2.P$26 U3.P$26)